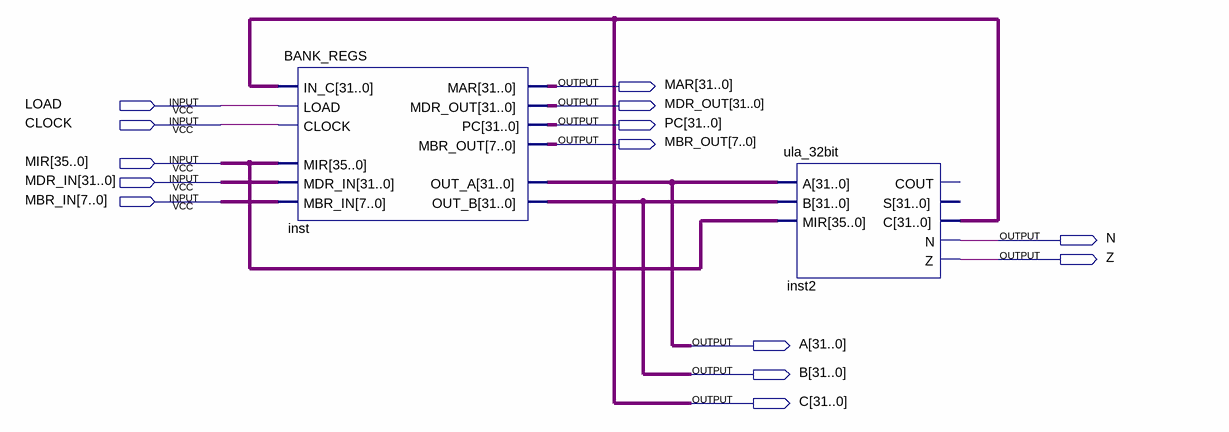
[diagram p0: schematic sheet]
// Quartus schematic DATA_PATH.bdf as structural Verilog: 2 symbols, 14 pins
module DATA_PATH (
  input  LOAD,
  input  CLOCK,
  input  [35:0] MIR,
  input  [31:0] MDR_IN,
  input  [7:0] MBR_IN,
  output [31:0] MAR,
  output [31:0] MDR_OUT,
  output [31:0] PC,
  output [7:0] MBR_OUT,
  output N,
  output Z,
  output [31:0] A,
  output [31:0] B,
  output [31:0] C
);

  BANK_REGS inst (
    .IN_C(C), .LOAD(LOAD), .CLOCK(CLOCK), .MIR(MIR), .MDR_IN(MDR_IN), .MBR_IN(MBR_IN), .MAR(MAR),
    .MDR_OUT(MDR_OUT), .PC(PC), .MBR_OUT(MBR_OUT), .OUT_A(A), .OUT_B(B));
  ula_32bit inst2 (.A(A), .B(B), .MIR(MIR), .C(C), .N(N), .Z(Z));  // open: COUT, S
endmodule
